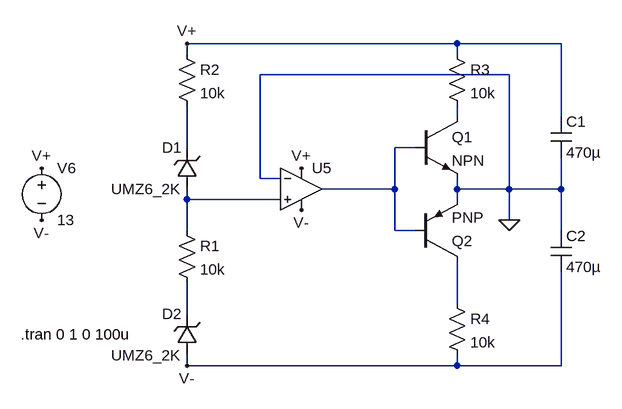
[diagram p0: schematic uni_2_bipo.asc]
uni_2_bipo.asc, the LTspice schematic file:
Version 4
SHEET 1 3040 680
WIRE 2448 -112 2032 -112
WIRE 2608 -112 2448 -112
WIRE 2032 -96 2032 -112
WIRE 2448 -96 2448 -112
WIRE 2528 -64 2144 -64
WIRE 2448 0 2448 -16
WIRE 2608 0 2608 -112
WIRE 2032 48 2032 -16
WIRE 2384 48 2352 48
WIRE 2144 96 2144 -64
WIRE 2176 96 2144 96
WIRE 2352 112 2352 48
WIRE 2352 112 2240 112
WIRE 2448 112 2448 96
WIRE 2528 112 2528 -64
WIRE 2528 112 2448 112
WIRE 2608 112 2608 64
WIRE 2608 112 2528 112
WIRE 2032 128 2032 112
WIRE 2176 128 2032 128
WIRE 2448 128 2448 112
WIRE 2528 160 2528 112
WIRE 2032 176 2032 128
WIRE 2352 176 2352 112
WIRE 2384 176 2352 176
WIRE 2608 176 2608 112
WIRE 2448 288 2448 224
WIRE 2032 304 2032 256
WIRE 2032 384 2032 368
WIRE 2448 384 2448 368
WIRE 2448 384 2032 384
WIRE 2608 384 2608 240
WIRE 2608 384 2448 384
FLAG 1808 80 V+
FLAG 1808 160 V-
FLAG 2208 80 V+
FLAG 2208 144 V-
FLAG 2032 -112 V+
FLAG 2032 384 V-
FLAG 2528 160 0
SYMBOL voltage 1808 64 R0
WINDOW 123 0 0 Left 0
WINDOW 39 0 0 Left 0
SYMATTR InstName V6
SYMATTR Value 13
SYMBOL OpAmps\\UniversalOpamp2 2208 112 R0
SYMATTR InstName U5
SYMATTR SpiceModel level.3b
SYMBOL pnp 2384 224 M180
SYMATTR InstName Q2
SYMBOL cap 2592 0 R0
SYMATTR InstName C1
SYMATTR Value 470µ
SYMATTR SpiceLine IC 0.1
SYMBOL cap 2592 176 R0
SYMATTR InstName C2
SYMATTR Value 470µ
SYMATTR SpiceLine IC 0.1
SYMBOL npn 2384 0 R0
SYMATTR InstName Q1
SYMBOL zener 2048 112 R180
WINDOW 0 24 64 Left 2
WINDOW 3 24 0 Left 2
SYMATTR InstName D1
SYMATTR Value UMZ6_2K
SYMATTR Description Diode
SYMATTR Type diode
SYMBOL zener 2048 368 R180
WINDOW 0 24 64 Left 2
WINDOW 3 24 0 Left 2
SYMATTR InstName D2
SYMATTR Value UMZ6_2K
SYMATTR Description Diode
SYMATTR Type diode
SYMBOL res 2016 160 R0
SYMATTR InstName R1
SYMATTR Value 10k
SYMBOL res 2016 -112 R0
SYMATTR InstName R2
SYMATTR Value 10k
SYMBOL res 2432 -112 R0
SYMATTR InstName R3
SYMATTR Value 10k
SYMBOL res 2432 272 R0
SYMATTR InstName R4
SYMATTR Value 10k
TEXT 1776 336 Left 2 !.tran 0 1 0 100u

The netlist it stands for:
* uni_2_bipo.asc
V6 V+ V- 13
XU5 N004 0 V+ V- N003 level.3b Avol=1Meg GBW=10Meg Slew=10Meg ilimit=25m rail=0 Vos=0 phimargin=45 en=0 enk=0 in=0 ink=0 Rin=500Meg  ; pins IN+ IN- V+ V- OUT
Q2 N005 N003 0 0 PNP
C1 V+ 0 470µ IC 0.1
C2 0 V- 470µ IC 0.1
Q1 N001 N003 0 0 NPN
D1 N004 N002 UMZ6_2K
D2 V- N006 UMZ6_2K
R1 N004 N006 10k
R2 V+ N002 10k
R3 V+ N001 10k
R4 N005 V- 10k
.model D D
.lib standard.dio
.model NPN NPN
.model PNP PNP
.lib standard.bjt
.tran 0 1 0 100u
.lib UniversalOpamps2.sub
.backanno
.end